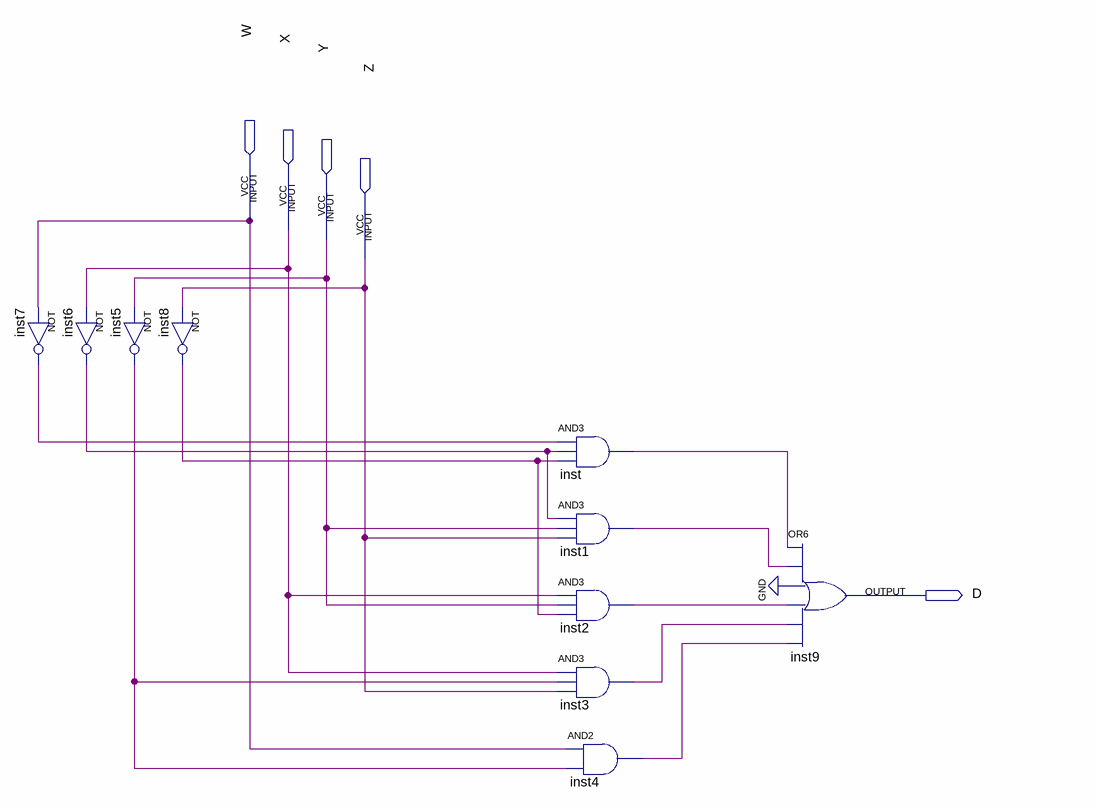
[diagram p0: schematic sheet]
// Quartus schematic SEG_D.bdf as structural Verilog: 10 symbols, 5 pins
module SEG_D (
  input  W,
  input  X,
  input  Y,
  input  Z,
  output D
);

  wire inst1_out, inst2_out, inst3_out, inst4_out, inst5_out, inst6_out, inst7_out, inst8_out, inst_out;

  not inst6 (inst6_out, X);
  not inst7 (inst7_out, W);
  not inst5 (inst5_out, Y);
  not inst8 (inst8_out, Z);
  and inst (inst_out, inst7_out, inst6_out, inst8_out);
  and inst1 (inst1_out, inst6_out, Y, Z);
  and inst2 (inst2_out, X, Y, inst8_out);
  and inst3 (inst3_out, X, inst5_out, Z);
  and inst4 (inst4_out, W, inst5_out);
  or inst9 (D, inst_out, inst1_out, 1'b0, inst2_out, inst3_out, inst4_out);
endmodule
